# Altium schematic sheet PF5c_Filter1B.SchDoc
size A
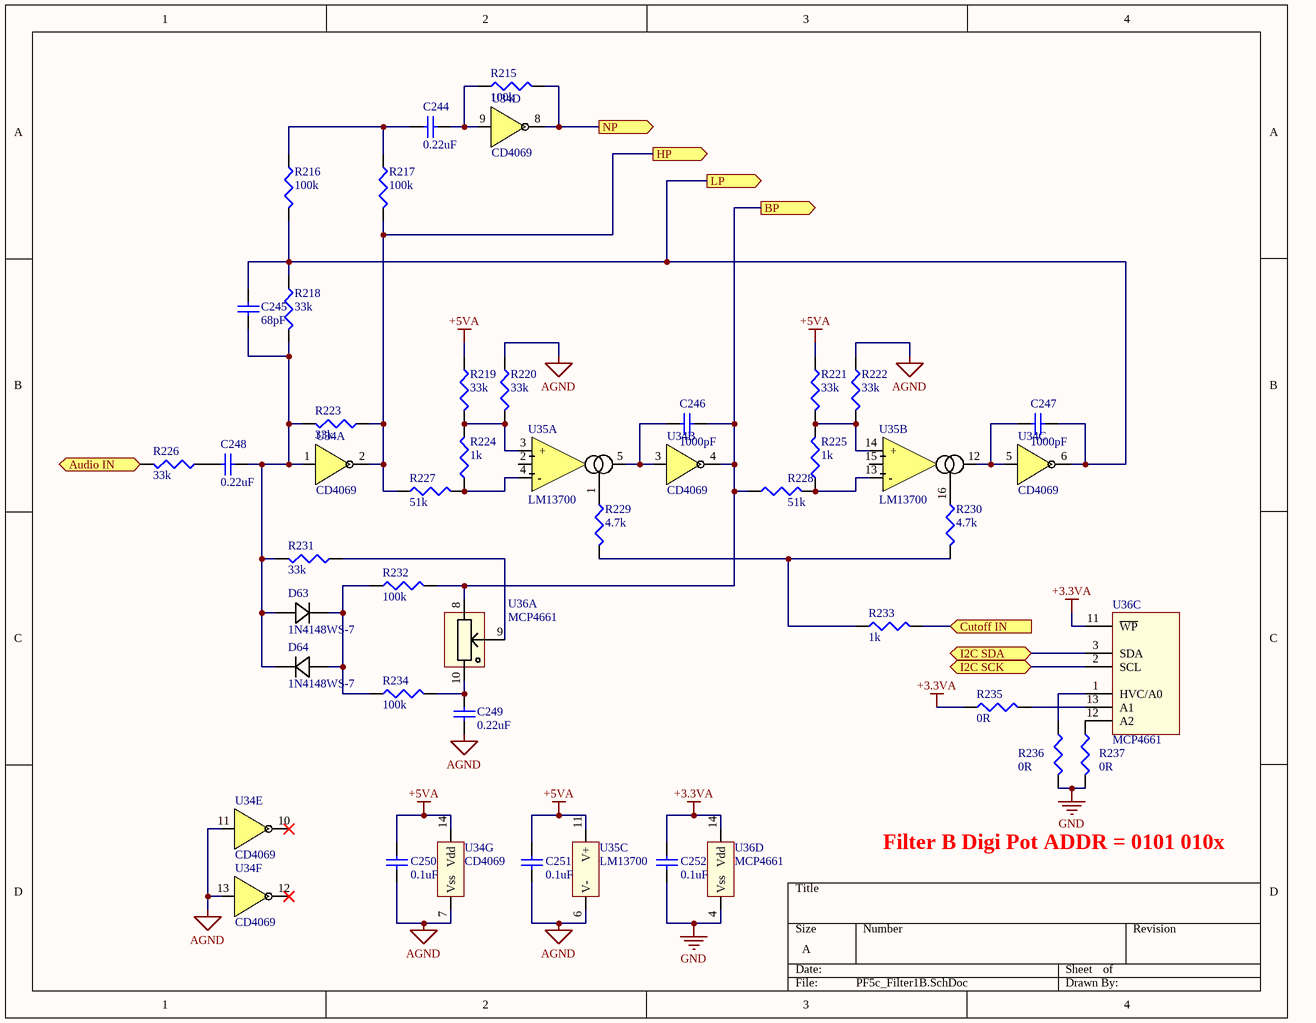
[diagram p0: PF5c_Filter1B.SchDoc]

## Parts
C244  0.22uF  [CAPC1608X08]
C245  68pF  [CAPC1608X08]
C246  1000pF  [CAPC1608X08]
C247  1000pF  [CAPC1608X08]
C248  0.22uF  [CAPC1608X08]
C249  0.22uF  [CAPC1608X08]
C250  0.1uF  [CAPC1608X08]
C251  0.1uF  [CAPC1608X08]
C252  0.1uF  [CAPC1608X08]
D63  1N4148WS-7  [SOD323-M]
D64  1N4148WS-7  [SOD323-M]
R215  100k  [RESC1608X05]
R216  100k  [RESC1608X05]
R217  100k  [RESC1608X05]
R218  33k  [RESC1608X05]
R219  33k  [RESC1608X05]
R220  33k  [RESC1608X05]
R221  33k  [RESC1608X05]
R222  33k  [RESC1608X05]
R223  33k  [RESC1608X05]
R224  1k  [RESC1608X05]
R225  1k  [RESC1608X05]
R226  33k  [RESC1608X05]
R227  51k  [RESC1608X05]
R228  51k  [RESC1608X05]
R229  4.7k  [RESC1608X05]
R230  4.7k  [RESC1608X05]
R231  33k  [RESC1608X05]
R232  100k  [RESC1608X05]
R233  1k  [RESC1608X05]
R234  100k  [RESC1608X05]
R235  0R  [RESC1608X05]
R236  0R  [RESC1608X05]
R237  0R  [RESC1608X05]
U34  CD4069  [D14-M]  (parts A,B,C,D,E,F,G of 7)
U35  LM13700  [SO16NB]  (parts A,B,C of 3)
U36  MCP4661  [TSSOP14_MC-M]  (parts A,C,D of 4)

## Ports
Audio IN (in), BP (out), Cutoff IN (in), HP (out), I2C SCK, I2C SDA, LP (out), NP (out)

## Nets
+3.3VA: C252.1 R235.1 U36.11(~{WP}) U36.14(Vdd)
+5VA: C250.1 C251.1 R219.1 R221.1 U34.14(Vdd) U35.11(V+)
AGND: C249.1 C250.2 C251.2 R220.1 R222.1 U34.7(Vss) U34.11(E) U34.13(F) U35.6(V-)
GND: C252.2 R236.2 R237.2 U36.4(Vss)
Audio IN: R226.2 ; port Audio IN
BP: C246.2 R228.1 R232.2 U34.4(~{B}) U36.8(P0A) ; port BP
Cutoff IN: R233.2 ; port Cutoff IN
HP: R217.2 R223.1 R227.1 U34.2(~{A}) ; port HP
I2C SCK: U36.2(SCL) ; port I2C SCK
I2C SDA: U36.3(SDA) ; port I2C SDA
LP: C245.2 C247.2 R216.2 R218.1 U34.6(~{C}) ; port LP
NP: R215.2 U34.8(~{D}) ; port NP
NetC244_1: C244.1 R215.1 U34.9(D)
NetC244_2: C244.2 R216.1 R217.1
NetC245_1: C245.1 C248.1 D63.2 D64.1 R218.2 R223.2 R231.2 U34.1(A)
NetC246_1: C246.1 U34.3(B) U35.5(OUT)
NetC247_1: C247.1 U34.5(C) U35.12(OUT)
NetC248_2: C248.2 R226.1
NetC249_2: C249.2 R234.2 U36.10(P0B)
NetD63_1: D63.1 D64.2 R232.1 R234.1
NetR219_2: R219.2 R220.2 R224.2 U35.3(+)
NetR221_2: R221.2 R222.2 R225.2 U35.14(+)
NetR224_1: R224.1 R227.2 U35.4(-)
NetR225_1: R225.1 R228.2 U35.13(-)
NetR229_1: R229.1 U35.1(BIAS)
NetR229_2: R229.2 R230.2 R233.1
NetR230_1: R230.1 U35.16(BIAS)
NetR231_1: R231.1 U36.9(P0W)
NetR235_2: R235.2 U36.13(A1)
NetR236_1: R236.1 U36.1(HVC/A0)
NetR237_1: R237.1 U36.12(A2)

Not connected (* = marked no-connect by the designer): U34 10(~{E})* 12(~{F})*; U35 2(Diode_BIAS) 15(Diode_BIAS)

## Notes on the sheet
- Filter B Digi Pot ADDR = 0101 010x

## Library data of the parts
C244 C248 C249 = Cap Semi: Capacitor (Semiconductor SIM Model); Fabricant: MURATA; Fournisseur: Farnell; RefFabricant: GRM188R71A224KA01D; RefFournisseur: 2695909; Value: 0.22uF; Case: 0603 [1608 Metric]; DataSheet: http://www.farnell.com/datasheets/2048635.pdf
C245 = Cap Semi: Capacitor (Semiconductor SIM Model); Fabricant: MURATA; Fournisseur: Farnell; RefFabricant: GRT1885C1H680JA02D; RefFournisseur: 2672146; Value: 68pF; Case: 0603 [1608 Metric]; DataSheet: http://www.farnell.com/datasheets/2165946.pdf
C246 C247 = Cap Semi: Capacitor (Semiconductor SIM Model); Fabricant: MURATA; Fournisseur: Farnell; RefFabricant: GRT1885C1H102JA02D; RefFournisseur: 2672134; Value: 1000pF; Case: 0603 [1608 Metric]; DataSheet: http://www.farnell.com/datasheets/2165937.pdf
C250-C252 = Cap Semi: Capacitor (Semiconductor SIM Model); Fabricant: MURATA; Fournisseur: Farnell; RefFabricant: GRM188F51E104ZA01D; RefFournisseur: 2821272; Value: 0.1uF; Case: 0603 [1608 Metric]; DataSheet: http://www.farnell.com/datasheets/2048672.pdf
D63 D64 = 1N4148WS-7: Diode signaux faibles; Fabricant: ON SEMICONDUCTOR; Fournisseur: Farnell; RefFournisseur: 2453269; DataSheet: http://www.farnell.com/datasheets/2288055.pdf; RefFabricant: 1N4148WS
R215-R217 R232 R234 = Res3: Resistor; Fabricant: TE CONNECTIVITY; Fournisseur: Farnell; RefFabricant: RN73C1J100KBTDF; RefFournisseur: 2687850; Value: 100k; Case: 0603 [1608 Metric]; DataSheet: http://www.farnell.com/datasheets/2189072.pdf
R218-R223 R226 R231 = Res3: Resistor; Fabricant: TE CONNECTIVITY; Fournisseur: Farnell; RefFabricant: CPF-A-0603B33KE1; RefFournisseur: 2483920; Value: 33k; Case: 0603 [1608 Metric]
R224 R225 R233 = Res3: Resistor; Fabricant: TE CONNECTIVITY; Fournisseur: Farnell; RefFabricant: CPF-A-0603B1K0E1; RefFournisseur: 2483880; Value: 1k; Case: 0603 [1608 Metric]; DataSheet: http://www.farnell.com/datasheets/1935020.pdf
R227 R228 = Res3: Resistor; Fabricant: TE CONNECTIVITY; Fournisseur: Farnell; RefFabricant: CPF0603B51KE1; RefFournisseur: 2331265; Value: 51k; Case: 0603 [1608 Metric]; DataSheet: http://www.farnell.com/datasheets/2043335.pdf
R229 R230 = Res3: Resistor; Fabricant: TE CONNECTIVITY; Fournisseur: Farnell; RefFabricant: CPF-A-0603B4K7E1; RefFournisseur: 2483933; Value: 4.7k; Case: 0603 [1608 Metric]; DataSheet: http://www.farnell.com/datasheets/1935020.pdf
R235-R237 = Res3: Resistor; Value: 0; Case: 0603 [1608 Metric]
U34 = CD4069: Hex Inverter; Fabricant: TEXAS INSTRUMENTS; Fournisseur: Farnell; RefFabricant: CD4069UBM; RefFournisseur: 1607751; DataSheet: http://www.ti.com/lit/ds/symlink/cd4069ub.pdf
U35 = LM13700M: Dual Transconductance OpAmp; Fabricant: TEXAS INSTRUMENTS; Fournisseur: Farnell; RefFabricant: LM13700M/NOPB; RefFournisseur: 1468910; DataSheet: http://www.ti.com/lit/ds/symlink/lm13700.pdf
U36 = MCP4661: Dual DigiPot non volatile I2C; RefFournisseur: 1840724; RefFabricant: MCP4661-503E/ST; Fournisseur: Farnell; Fabricant: MICROCHIP; DataSheet: http://www.farnell.com/datasheets/2243913.pdf